# EAGLE design gps_auxiliary (EAGLE 9.4.2)
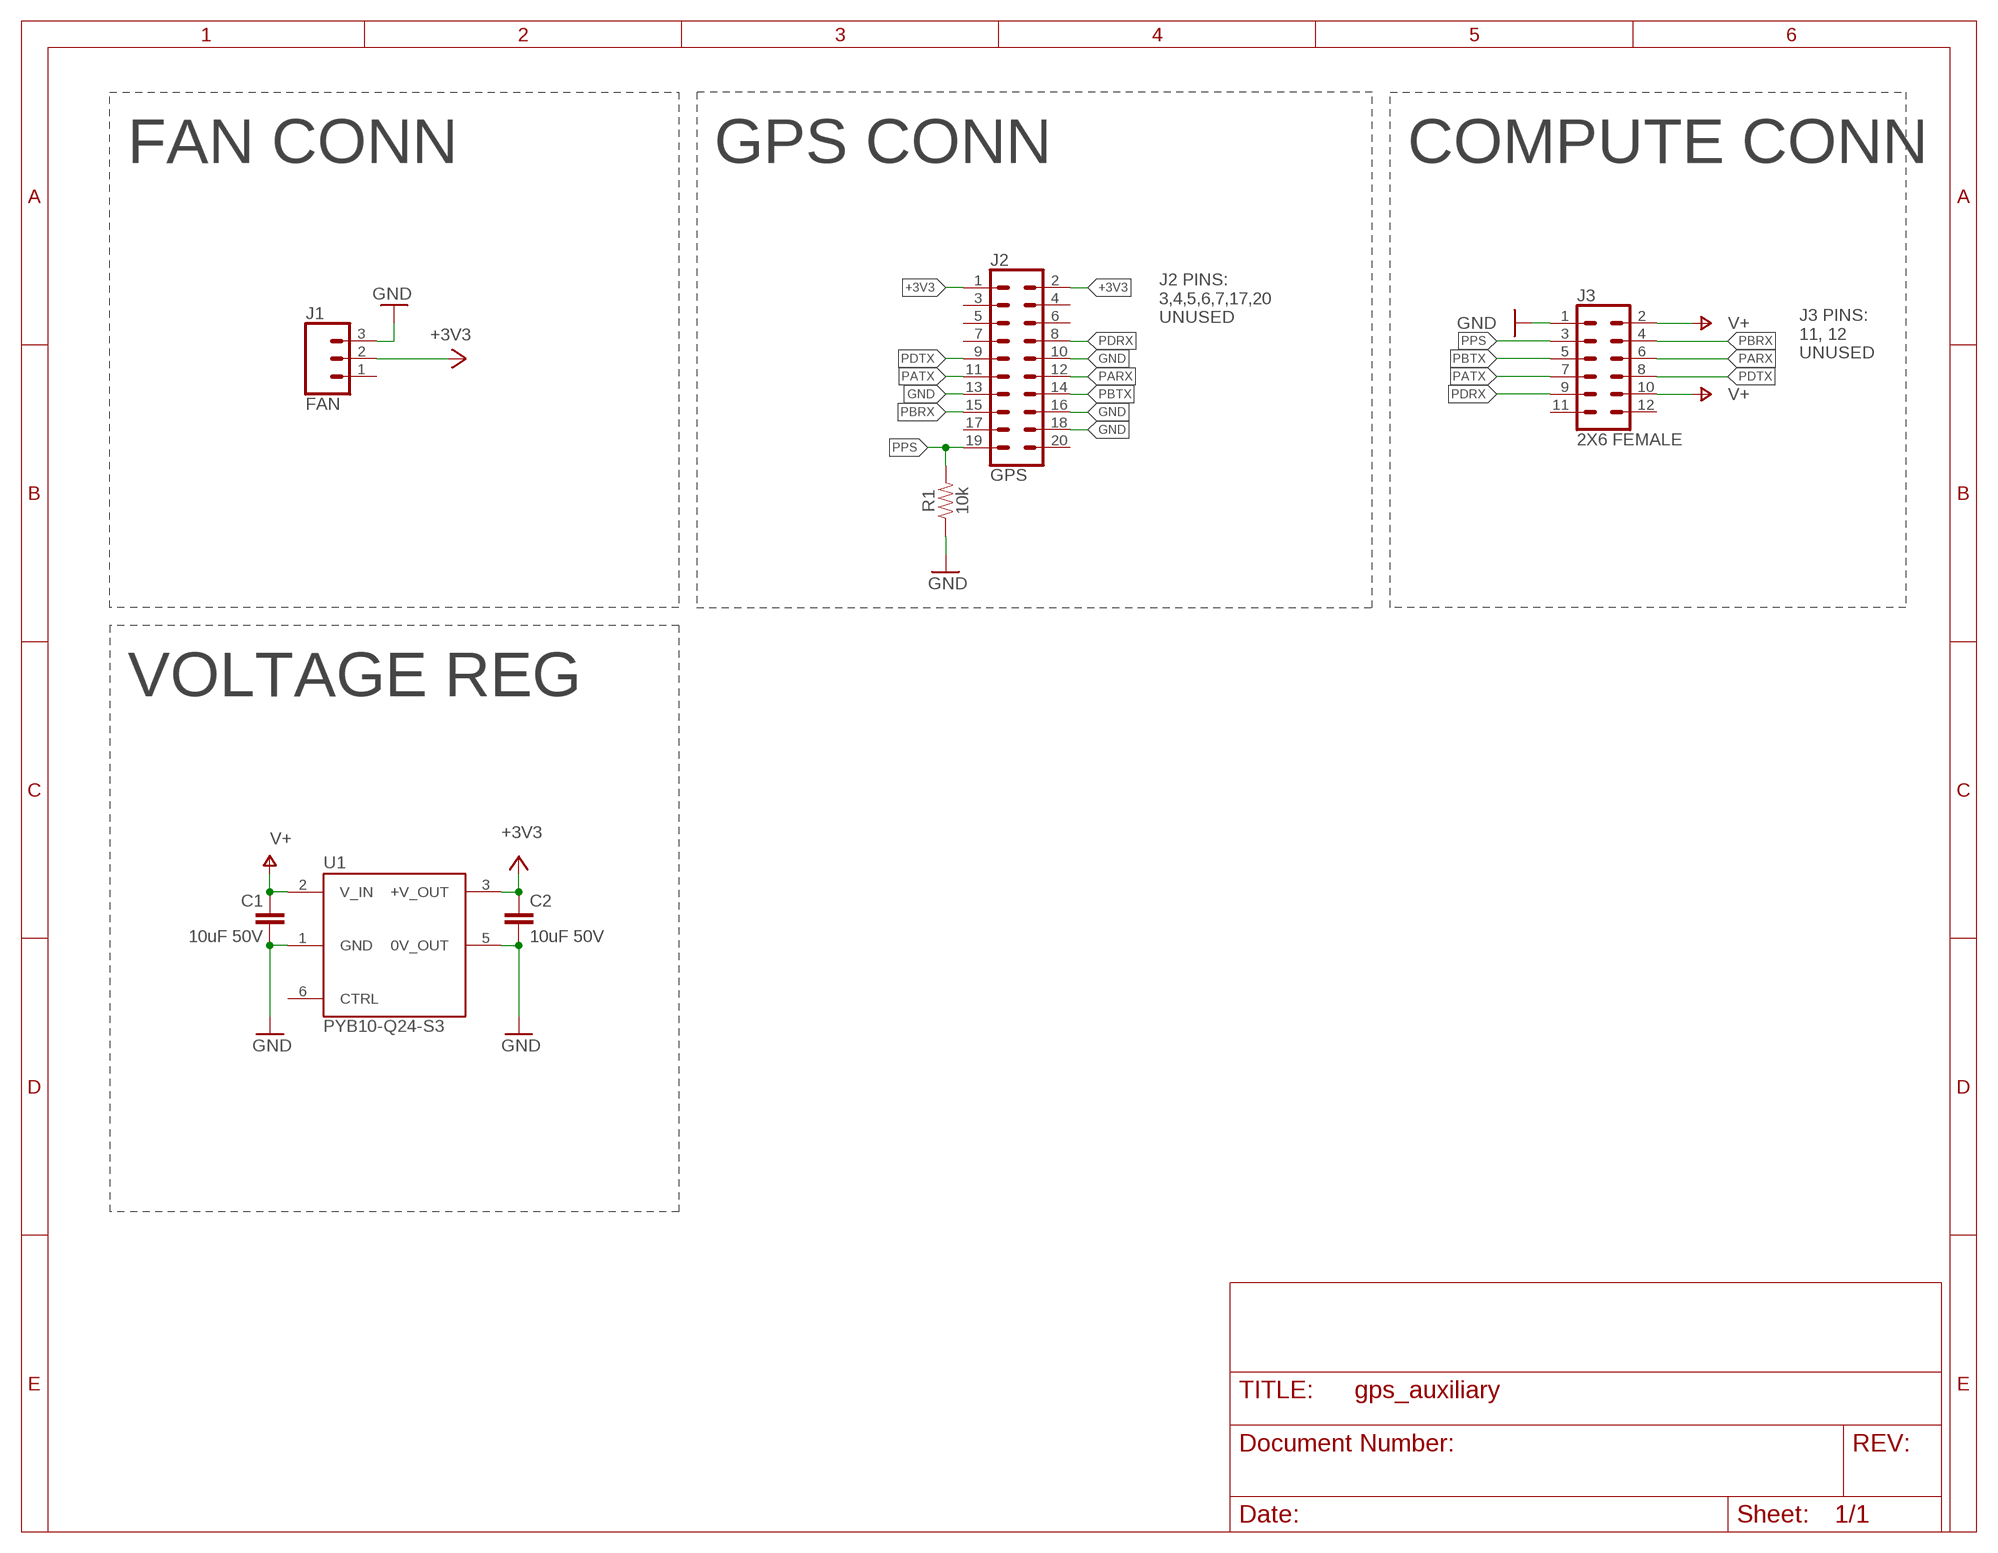
[diagram p0: schematic, sheet 1]

## Parts
C1  10uF 50V  CAP-5MM  [CAP-PTH-5MM]
C2  10uF 50V  CAP-5MM  [CAP-PTH-5MM]
J1  FAN  ED700/3  [ED700]
J2  GPS  EHT-110-01-S-D  [EHT-110-01-S-D]
J3  2X6 FEMALE  CONN_06X2PTH_FEMALE  [2X6]
R1  10k  CFR-25JB-52-10K  [AXIAL-0.3]
U1  PYB10-Q24-S3  [PYB10]

## Nets
+3V3: C2.1 J1.2 J2.1 J2.2 U1.3(+V_OUT)
GND: C1.2 C2.2 J1.3 J2.10 J2.13 J2.16 J2.18 J3.1 R1.1 U1.1(GND) U1.5(0V_OUT)
PARX: J2.12 J3.6
PATX: J2.11 J3.7
PBRX: J2.15 J3.4
PBTX: J2.14 J3.5
PDRX: J2.8 J3.9
PDTX: J2.9 J3.8
PPS: J2.19 J3.3 R1.2
V+: C1.1 J3.2 J3.10 U1.2(V_IN)
Unconnected: J1.1 J2.3 J2.4 J2.5 J2.6 J2.7 J2.17 J2.20 J3.11 J3.12 U1.6(CTRL)

## Notes on the sheet
- FAN CONN | GPS CONN | COMPUTE CONN
- J2 PINS:
  3,4,5,6,7,17,20
  UNUSED
- J3 PINS:
  11, 12
  UNUSED
- VOLTAGE REG

## Library data of the parts
C1 C2 = gps_auxiliary:CAP-5MM
J1 = gps_auxiliary:ED700/3: 3-pin Screw Terminal (5mm); DKPN: ED1632-ND
J2 = gps_auxiliary:EHT-110-01-S-D: 20 Position (2x10) Locking Vertical Connector (2mm); DKPN: SAM8557-ND
J3 = gps_auxiliary:CONN_06X2: Multi connection point. Often used as Generic Header-pin footprint for 0.1 inch spaced/style header connections On any of the 0.1 inch spaced packages, you can populate with these: Break Away Headers - Straight <https://www.sparkfun.com/products/116> (PRT-00116) Break Away Male Headers - Right Angle <https://www.sparkfun.com/products/553> (PRT-00553) Female Headers <https://www.sparkfun.com/products/115> (PRT-00115) Break Away Headers - Machine Pin <https://www.sparkfun.com/products/117> (PRT-00117) Break Away Female Headers - Swiss Machine Pin <https://www.sparkfun.com/products/743> (PRT-00743); PROD_ID: CONN-12423
R1 = gps_auxiliary:CFR-25JB-52-10K; DKPN: 10KQBK-ND
U1 = gps_auxiliary:PYB10-Q24-S3: DC DC CONVERTER 3.3V 10W; DKPN: 102-2852-ND

## Board
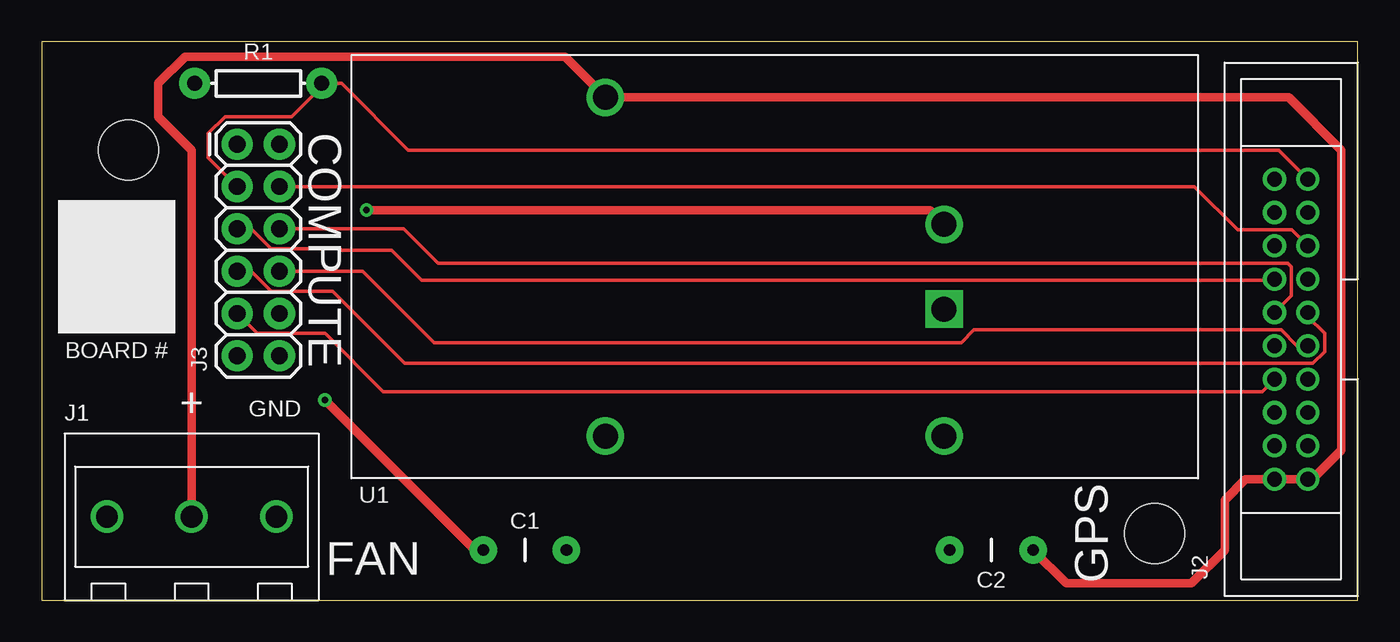
[diagram p1: board, top side]
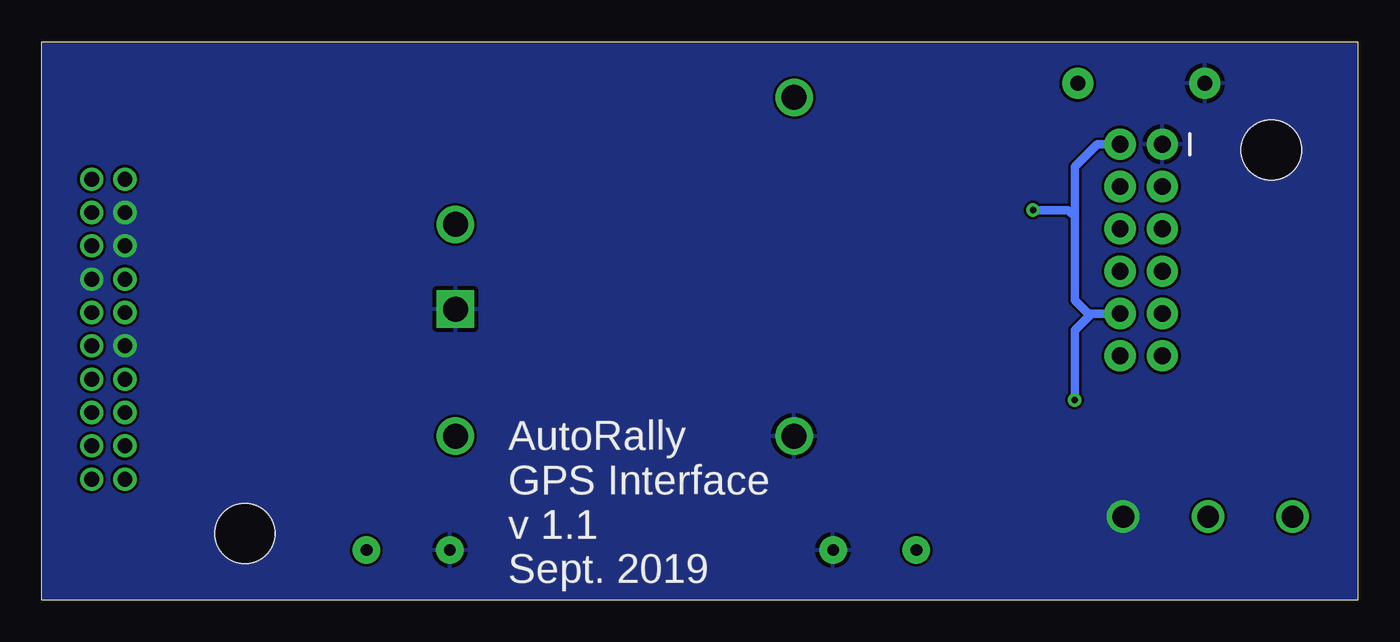
[diagram p2: board, bottom side, seen from below]

Size 79 x 33.5 mm. Coordinates in mm from the lower left corner, seen from the top.
Outline: 0,0 79,0 79,33.5 0,33.5 0,0
Copper layers (1*16): Top 0.0356mm / dielectric 63mil / Bottom 0.0356mm
Design rules "RJ2LayerDRU": minimum track width 6mil, minimum drill 15mil, track to track 6mil, track to pad 6mil, pad to pad 6mil, via to via 6mil, smd to smd 6mil, copper to edge 0mil, drill to drill 6mil, minimum pad ring 10mil, minimum via ring 8mil, stop-mask expansion 4mil, vias tented up to drill 0mil, thermal gap 10mil
Holes 3.6 mm at 5.2,27 66.8,4

### Footprints (pad centres in the part's own frame; a part is rotated, then mirrored left to right if it is on the bottom)
CAP-PTH-5MM = drill 0.7 pad 1.651: 1 -2.5,0; 2 2.5,0
ED700 = drill 1.3: 1 -5.08,0; 2 0,0; 3 5.08,0
EHT-110-01-S-D = drill 0.89: 1 -9,-1; 2 -9,1; 3 -7,-1; 4 -7,1; 5 -5,-1; 6 -5,1; 7 -3,-1; 8 -3,1; 9 -1,-1; 10 -1,1; 11 1,-1; 12 1,1; 13 3,-1; 14 3,1; 15 5,-1; 16 5,1; 17 7,-1; 18 7,1; 19 9,-1; 20 9,1
2X6 = drill 1.016 pad 1.88: 1 -6.35,-1.27; 2 -6.35,1.27; 3 -3.81,-1.27; 4 -3.81,1.27; 5 -1.27,-1.27; 6 -1.27,1.27; 7 1.27,-1.27; 8 1.27,1.27; 9 3.81,-1.27; 10 3.81,1.27; 11 6.35,-1.27; 12 6.35,1.27
AXIAL-0.3 = drill 0.9 pad 1.88: 1 -3.81,0; 2 3.81,0
PYB10 = drill 1.5 square: 1 -10.16,2.54 | drill 1.5: 2 -10.16,-2.54; 3 10.16,-10.16; 5 10.16,10.16; 6 -10.16,10.16

### Placement (x,y rotation side)
C1  29,3 0 top
C2  57,3 180 top
J1  9,5 0 top
J2  75,16.25 90 top
J3  13,21 270 top
R1  13,31 0 top
U1  44,20 180 top

### Tracks (layer width: path | path; a pad name or v marks a point on that pad's centre or on a via)
+3V3
  Top 0.5: J1.2 9,27 7,29 7,31 8.6,32.6 31.4,32.6 U1.3 74.84,30.16 78,27 78,9 76.25,7.25 J2.1 J2.2 72.25,7.25 71,6 71,3 69,1 61.5,1 C2.1
GND
  pour Bottom: 0,33.5 79,33.5 79,0 0,0
PARX
  Top 0.2: J3.6 21.73,22.27 23.8,20.2 74.8,20.2 75,20 75,18.25 J2.12
PATX
  Top 0.2: J3.7 12.58,19.73 13.78,18.54 17.46,18.54 21.8,14.2 76.3,14.2 77,14.9 77,16 76,17 J2.11
PBRX
  Top 0.2: J3.4 69.19,24.81 71.8,22.2 75.05,22.2 J2.15
PBTX
  Top 0.2: J3.5 12.58,22.27 13.78,21.08 17.92,21.08 18,21 21,21 22.8,19.2 73.35,19.2 73.4,19.25 J2.14
PDRX
  Top 0.2: J3.9 12.92,16 14.76,16 14.77,16 17,16 20.5,12.5 73.25,12.5 J2.8
PDTX
  Top 0.2: J2.9 75.34,15.25 74.39,16.2 55.95,16.2 55.2,15.45 23.55,15.45 19.27,19.73 J3.8
PPS
  Top 0.2: J3.3 10,26.54 10,28 11,29 15,29 16.81,30.81 R1.2 18,31 22,27 74.25,27 J2.19
V+  (via drill 0.38)
  Top 0.5: v19.5,23.4 53.3,23.4 U1.2 | v17,12 26,3 C1.1
  Bottom 0.5: J3.10 16,17.19 | 16,17.19 16.19,17.19 17,18 17,23 | 17,23 17,26 15.65,27.35 J3.2 | 17,23 17.4,23.4 v19.5,23.4 | 16,17.19 17,16.19 v17,12

### Text on the board
tPlace: COMPUTE | BOARD # | + | GND | GPS | FAN
bPlace: AutoRally / GPS Interface / v 1.1 / Sept. 2019